# Altium schematic sheet main.SchDoc
size A4
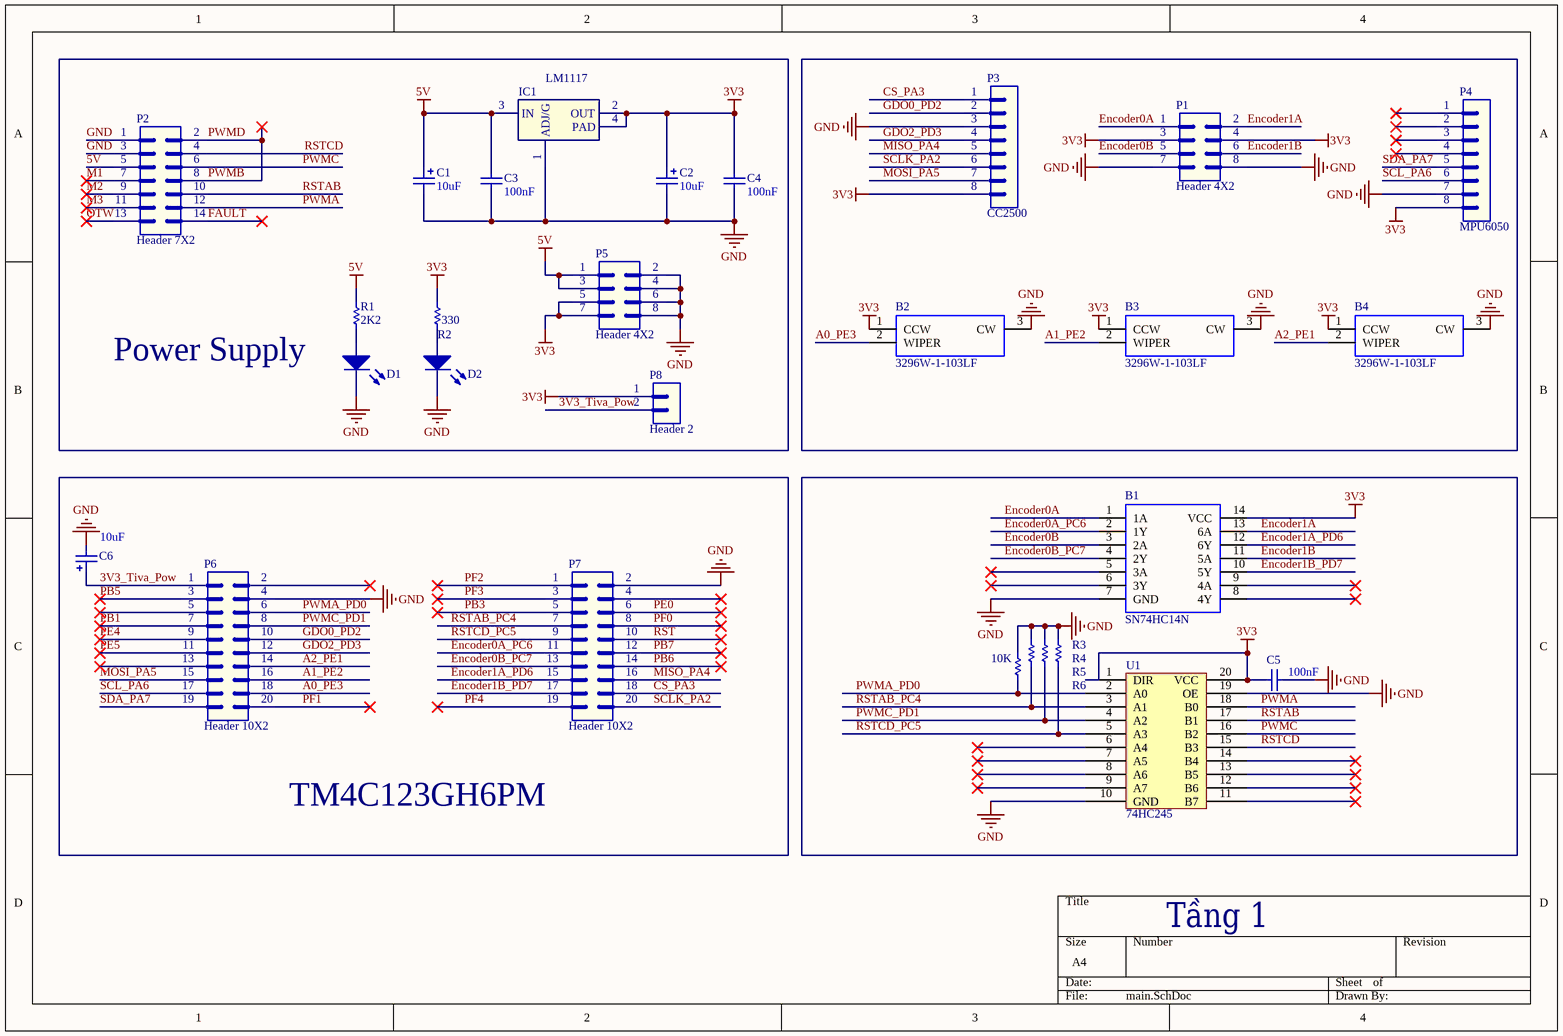
[diagram p0: main.SchDoc]

## Parts
B1  SN74HC14N  [DIP254P762X508-14]
B2  3296W-1-103LF  [SHDR3W54P0X254_1X3_953X483X1155P]
B3  3296W-1-103LF  [SHDR3W54P0X254_1X3_953X483X1155P]
B4  3296W-1-103LF  [SHDR3W54P0X254_1X3_953X483X1155P]
C1  Capacitance: 10uF  [CAP TANTALUM SMD-1206]  (hidden comment: Capacitors)
C2  Capacitance: 10uF  [CAP TANTALUM SMD-1206]  (hidden comment: Capacitors)
C3  value 100nF  [CAP-SM-0805]  (hidden comment: Cap Non-Pol SMD)
C4  value 100nF  [CAP-SM-0805]  (hidden comment: Cap Non-Pol SMD)
C5  value 100nF  [CN1]  (hidden comment: Cap Non-Pol)
C6  Capacitance: 10uF  [CAP TANTALUM SMD-1206]  (hidden comment: Capacitors)
D1  LED  [LED-5mm]  (value not drawn)
D2  LED  [LED-5mm]  (value not drawn)
IC1  LM1117  [SOT223-4N]
P1  Header 4X2  [JP4x2]
P2  Header 7X2  [JP7X2]
P3  CC2500  [JP8]
P4  MPU6050  [JP8]
P5  Header 4X2  [JP4x2]
P6  Header 10X2  [JP10X2]
P7  Header 10X2  [JP10X2]
P8  Header 2  [JP2]
R1  value 2K2  [RES 1/2W]  (hidden comment: Resistor 1/4W)
R2  value 330  [RES 1/2W]  (hidden comment: Resistor 1/4W)
R3  Resistor 1/4W  [RES 1/2W]  (value not drawn)
R4  Resistor 1/4W  [RES 1/2W]  (value not drawn)
R5  Resistor 1/4W  [RES 1/2W]  (value not drawn)
R6  value 10K  [RES 1/2W]  (hidden comment: Resistor 1/4W)
U1  74HC245  [DIP20/W0.3]

## Nets
3V3: B1.14(VCC) B2.1(CCW) B3.1(CCW) B4.1(CCW) C2.1 C4.2 C5.1 IC1.2(OUT) IC1.4(PAD) P1.3 P1.4 P3.8 P4.8 P5.5 P5.7 P8.1 R2.2 U1.1(DIR) U1.20(VCC)
5V: C1.1 C3.2 IC1.3(IN) P2.5 P5.1 P5.3 R1.2
GND: B1.7(GND) B2.3(CW) B3.3(CW) B4.3(CW) C1.2 C2.2 C3.1 C4.1 C5.2 C6.2 D1.2(K) D2.2(K) IC1.1(ADJ/G) P1.7 P1.8 P2.1 P2.3 P3.3 P4.7 P5.2 P5.4 P5.6 P5.8 P6.4 P7.2 R3.2 R4.2 R5.2 R6.2 U1.10(GND) U1.19(OE)
3V3_Tiva_Pow: C6.1 P6.1 P8.2
A0_PE3: B2.2(WIPER) P6.18
A1_PE2: B3.2(WIPER) P6.16
A2_PE1: B4.2(WIPER) P6.14
CS_PA3: P3.1 P7.18
Encoder0A: B1.1(1A) P1.1
Encoder0A_PC6: B1.2(1Y) P7.11
Encoder0B: B1.3(2A) P1.5
Encoder0B_PC7: B1.4(2Y) P7.13
Encoder1A: B1.13(6A) P1.2
Encoder1A_PD6: B1.12(6Y) P7.15
Encoder1B: B1.11(5A) P1.6
Encoder1B_PD7: B1.10(5Y) P7.17
FAULT: P2.14
GDO0_PD2: P3.2 P6.10
GDO2_PD3: P3.4 P6.12
M1: P2.7
M2: P2.9
M3: P2.11
MISO_PA4: P3.5 P7.16
MOSI_PA5: P3.7 P6.15
OTW: P2.13
PB1: P6.7
PB3: P7.5
PB5: P6.3
PB6: P7.14
PB7: P7.12
PE0: P7.6
PE4: P6.9
PE5: P6.11
PF0: P7.8
PF1: P6.20
PF2: P7.1
PF3: P7.3
PF4: P7.19
PWMA: P2.12 U1.18(B0)
PWMA_PD0: P6.6 R6.1 U1.2(A0)
PWMB: P2.2 P2.8  [also labelled PWMD]
PWMC: P2.6 U1.16(B2)
PWMC_PD1: P6.8 R4.1 U1.4(A2)
RST: P7.10
RSTAB: P2.10 U1.17(B1)
RSTAB_PC4: P7.7 R3.1 U1.3(A1)
RSTCD: P2.4 U1.15(B3)
RSTCD_PC5: P7.9 R5.1 U1.5(A3)
SCL_PA6: P4.6 P6.17
SCLK_PA2: P3.6 P7.20
SDA_PA7: P4.5 P6.19
NetD1_1: D1.1(A) R1.1
NetD2_1: D2.1(A) R2.1

Not connected (* = marked no-connect by the designer): B1 5(3A)* 6(3Y)* 8(4Y)* 9(4A)*; P4 1* 2* 3* 4*; P6 2* 5* 13*; P7 4*; U1 6(A4)* 7(A5)* 8(A6)* 9(A7)* 11(B7)* 12(B6)* 13(B5)* 14(B4)*

## Notes on the sheet
- Power Supply
- TM4C123GH6PM
- Tầng 1

## Library data of the parts
B1 = SN74HC14N: Hex invertor,SN74HC14N DIP14 2-6V 25pcs; Manufacturer_Name: Texas Instruments; Geometry.Height: mm; Supplier_Name: RS; RS Part Number: 0442943; Manufacturer_Part_Number: SN74HC14N; Allied_Number: *; Other Part Number: *; Datasheet Link: http://componentsearchengine.com/Datasheets/3/SN74HC14N.pdf; 3D Package: *
B2-B4 = 3296W-1-103LF: Bourns 3296W Series 25-Turn Through Hole Cermet Trimmer Resistor with Pin Terminations, 10000???? ????10% 1/2W ????100ppm/????C; Allied_Number: 70153918; Geometry.Height: 11.55mm; Supplier_Name: RS; RS Part Number: 5219647P; Manufacturer_Name: Bourns; Manufacturer_Part_Number: 3296W-1-103LF; Other Part Number: *; Datasheet Link: http://docs-europe.electrocomponents.com/webdocs/069c/0900766b8069ccf4.pdf; 3D Package: *
C1 C2 C6 = Cap Pol Tantalum: Capacitors Tantalum; Manufacturer: Kemet; Manufacturer Part Number: T491A106K010AT; Manufacturer Size Code: A; Tolerance: ±10%; Voltage - Rated: 10V; ESR (Equivalent Series Resistance): 3.8 Ohm; Type: Molded; Lifetime @ Temp.: 2000 Hrs @ 85°C; Supplier 1: Digi-Key; RoHS: RoHS Compliant; Category: Capacitors; Stock 1: 316000; Pricing 1: 2000=0.0626, 4000=0.05791, 10000=0.05478, 14000=0.05196, 50000=0.04695, 100000=0.04147 (USD); Packaging: Tape & Reel (TR); Part Status: Active; Operating Temperature: -55°C ~ 125°C; Mounting Type: Surface Mount; Package / Case: 1206 (3216 Metric); Size / Dimension: 0.126" L x 0.063" W (3.20mm x 1.60mm); Height - Seated (Max): 0.071" (1.80mm); Lead Spacing: -; Features: General Purpose; ComponentLink1URL: http://www.kemet.com/Lists/ProductCatalog/Attachments/254/KEM_T2005_T491.pdf; ComponentLink1Description: http://www.kemet.com/Lists/ProductCatalog/Attachments/254/KEM_T2005_T491.pdf
C3 C4 = Cap Non-Pol SMD: Capacitor
C5 = Cap Non-Pol: Capacitor
IC1 = LM1117: Available in 1.8V, 2.5V, 2.85V, 3.3V, 5V, and  Adjustable Versions; Value: LM317
P1 P5 = Header 4X2: Header, 4-Pin, Dual row; LatestRevisionDate: 17-Jul-2002; LatestRevisionNote: Re-released for DXP Platform.; Publisher: Altium Limited
P2 = Header 7X2: Header, 7-Pin, Dual row; LatestRevisionDate: 17-Jul-2002; LatestRevisionNote: Re-released for DXP Platform.; Publisher: Altium Limited
P3 P4 = Header 8: Header, 8-Pin; LatestRevisionDate: 17-Jul-2002; LatestRevisionNote: Re-released for DXP Platform.; Publisher: Altium Limited
P6 P7 = Header 10X2: Header, 10-Pin, Dual row; LatestRevisionDate: 17-Jul-2002; LatestRevisionNote: Re-released for DXP Platform.; Publisher: Altium Limited
P8 = Header 2: Header, 2-Pin; LatestRevisionDate: 17-Jul-2002; LatestRevisionNote: Re-released for DXP Platform.; Publisher: Altium Limited
R1-R6 = RES
U1 = 74HC245: Octal bus tranceiver